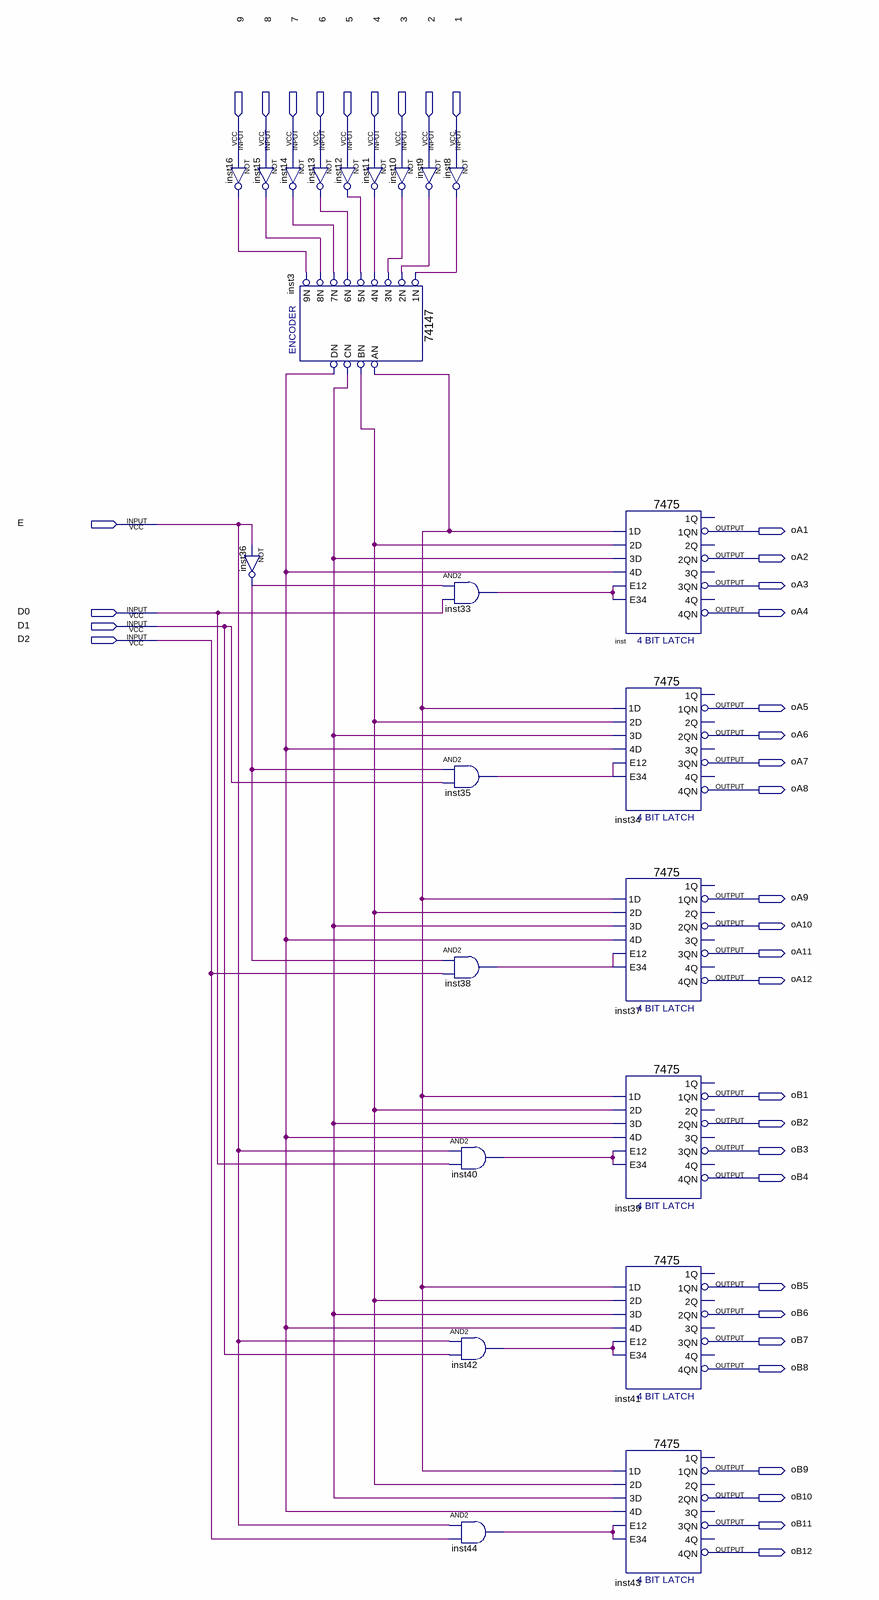
[diagram p0: schematic sheet]
// Quartus schematic TestProSelect.bdf as structural Verilog: 23 symbols, 37 pins
module TestProSelect (
  input  \9 ,
  input  \8 ,
  input  \7 ,
  input  \6 ,
  input  \5 ,
  input  \4 ,
  input  \3 ,
  input  \2 ,
  input  \1 ,
  input  E,
  input  D0,
  input  D1,
  input  D2,
  output oA1,
  output oA2,
  output oA3,
  output oA4,
  output oA5,
  output oA6,
  output oA7,
  output oA8,
  output oA9,
  output oA10,
  output oA11,
  output oA12,
  output oB1,
  output oB2,
  output oB3,
  output oB4,
  output oB5,
  output oB6,
  output oB7,
  output oB8,
  output oB9,
  output oB10,
  output oB11,
  output oB12
);

  wire inst3_an, inst3_bn, inst3_cn, inst3_dn, inst8_out, inst9_out, inst10_out, inst11_out, inst12_out,
       inst13_out, inst14_out, inst15_out, inst16_out, inst33_out, inst35_out, inst36_out, inst38_out,
       inst40_out, inst42_out, inst44_out;

  not inst16 (inst16_out, \9 );
  not inst14 (inst14_out, \7 );
  not inst15 (inst15_out, \8 );
  \74147  inst3 (
    .\1N (inst8_out), .\2N (inst9_out), .\3N (inst10_out), .\6N (inst13_out), .\5N (inst12_out),
    .\4N (inst11_out), .\9N (inst16_out), .\8N (inst15_out), .\7N (inst14_out), .CN(inst3_cn), .BN(inst3_bn),
    .AN(inst3_an), .DN(inst3_dn));
  not inst36 (inst36_out, E);
  not inst12 (inst12_out, \5 );
  not inst13 (inst13_out, \6 );
  not inst10 (inst10_out, \3 );
  not inst11 (inst11_out, \4 );
  not inst8 (inst8_out, \1 );
  not inst9 (inst9_out, \2 );
  and inst33 (inst33_out, inst36_out, D0);
  and inst35 (inst35_out, inst36_out, D1);
  and inst38 (inst38_out, inst36_out, D2);
  and inst40 (inst40_out, E, D0);
  and inst42 (inst42_out, E, D1);
  and inst44 (inst44_out, E, D2);
  \7475  inst (
    .E12(inst33_out), .\3D (inst3_cn), .\4D (inst3_dn), .\2D (inst3_bn), .E34(inst33_out), .\1D (inst3_an),
    .\1QN (oA1), .\3QN (oA3), .\4QN (oA4), .\2QN (oA2));  // open: 1Q, 2Q, 3Q, 4Q
  \7475  inst34 (
    .E12(inst35_out), .\3D (inst3_cn), .\4D (inst3_dn), .\2D (inst3_bn), .E34(inst35_out), .\1D (inst3_an),
    .\1QN (oA5), .\3QN (oA7), .\4QN (oA8), .\2QN (oA6));  // open: 1Q, 2Q, 3Q, 4Q
  \7475  inst37 (
    .E12(inst38_out), .\3D (inst3_cn), .\4D (inst3_dn), .\2D (inst3_bn), .E34(inst38_out), .\1D (inst3_an),
    .\1QN (oA9), .\3QN (oA11), .\4QN (oA12), .\2QN (oA10));  // open: 1Q, 2Q, 3Q, 4Q
  \7475  inst39 (
    .E12(inst40_out), .\3D (inst3_cn), .\4D (inst3_dn), .\2D (inst3_bn), .E34(inst40_out), .\1D (inst3_an),
    .\1QN (oB1), .\3QN (oB3), .\4QN (oB4), .\2QN (oB2));  // open: 1Q, 2Q, 3Q, 4Q
  \7475  inst41 (
    .E12(inst42_out), .\3D (inst3_cn), .\4D (inst3_dn), .\2D (inst3_bn), .E34(inst42_out), .\1D (inst3_an),
    .\1QN (oB5), .\3QN (oB7), .\4QN (oB8), .\2QN (oB6));  // open: 1Q, 2Q, 3Q, 4Q
  \7475  inst43 (
    .E12(inst44_out), .\3D (inst3_cn), .\4D (inst3_dn), .\2D (inst3_bn), .E34(inst44_out), .\1D (inst3_an),
    .\1QN (oB9), .\3QN (oB11), .\4QN (oB12), .\2QN (oB10));  // open: 1Q, 2Q, 3Q, 4Q
endmodule
